# Altium schematic sheet CAS_5.SchDoc
size A4; SheetNumber: 1; SheetTotal: 1
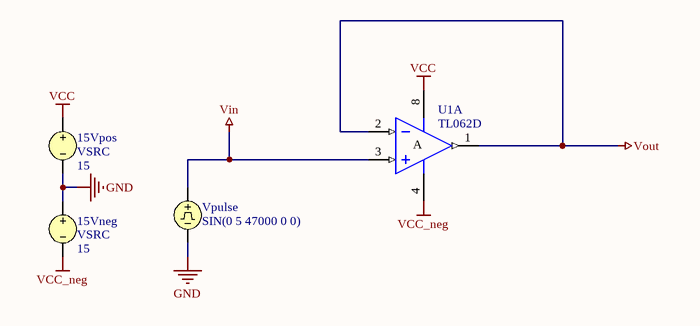
[diagram p0: CAS_5.SchDoc]

## Parts
15Vneg  VSRC  value 15
15Vpos  VSRC  value 15
U1  TL062D  [D008_L]  (part A of 2)
Vpulse  SIN(0 5 47000 0 0)

## Nets
GND: 15Vneg.1 15Vpos.2 Vpulse.2
VCC: 15Vpos.1 U1.8(V+)
VCC_neg: 15Vneg.2 U1.4(V-)
Vin: U1.3(IN+) Vpulse.1
Vout: U1.1(OUT) U1.2(IN-)

## Notes on the sheet
- (in symbol TL062D, part A) A

## Library data of the parts
15Vneg 15Vpos = VSRC: Voltage Source; Note: PCB Footprint - Not required; AC Magnitude: 1; AC Phase: 0; Published: 30-July-2020; LatestRevisionDate: 30-July-2020; LatestRevisionNote: Re-released for DXP Platform.; PackageReference: Not Applicable; Publisher: Altium Limited
U1 = TL062D: Low-Power JFET-Input Operational Amplifier; Published: 16-Jan-2001; LatestRevisionDate: 13-Apr-2006; LatestRevisionNote: IPC-7351 Footprint Added.; DatasheetVersion: Jan-1999; PackageVersion: Jan-1998; PackageReference: D008; Publisher: Altium Limited; PackageDescription: 8-Pin Small Outline Integrated Circuit 1.27 mm Pitch; Code_IPC: SOIC127P600-8; ComponentLink1Description: Manufacturer Link; ComponentLink1URL: http://www.ti.com/; ComponentLink2Description: Datasheet; ComponentLink2URL: http://www-s.ti.com/sc/ds/tl062.pdf
Vpulse = VPULSE: Pulse Voltage Source; Note: PCB Footprint - Not required; DC Magnitude: 0; AC Magnitude: 1; Amplitude: 5; Frequency: 47000; Published: 8-Jun-2000; LatestRevisionDate: 15-Nov-2004; LatestRevisionNote: Corrected Netlist.; PackageReference: Not Applicable; Publisher: Altium Limited; AC Phase: 0; Offset: 0; Delay: 0; Damping Factor: 0